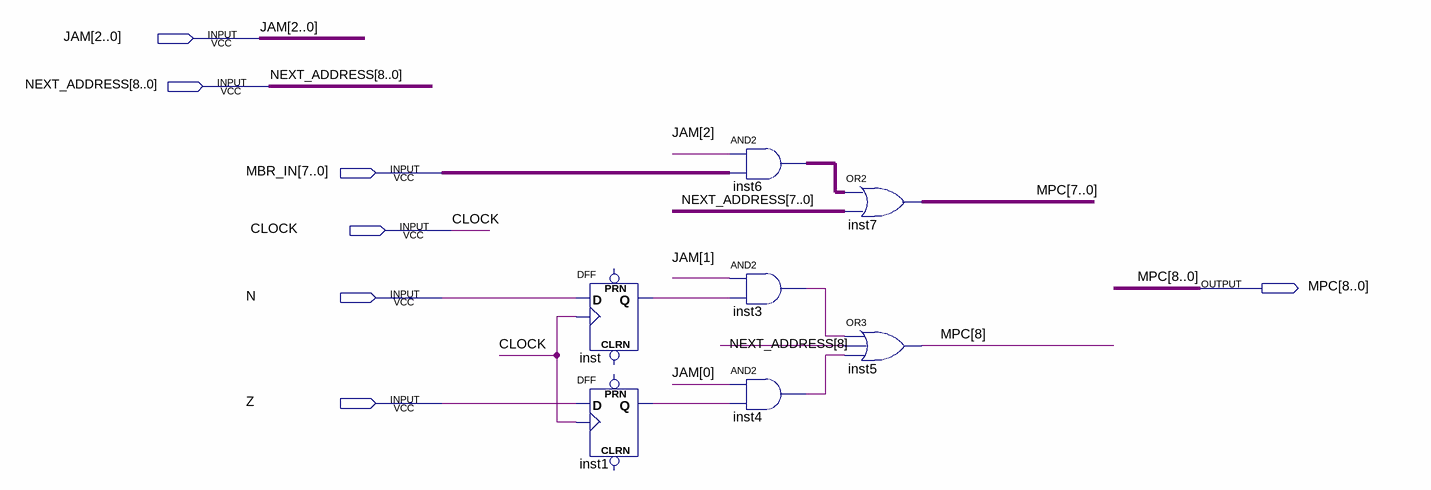
[diagram p0: schematic sheet]
// Quartus schematic MPC.bdf as structural Verilog: 7 symbols, 7 pins
module MPC (
  input  [2:0] JAM,
  input  [8:0] NEXT_ADDRESS,
  input  [7:0] MBR_IN,
  input  CLOCK,
  input  N,
  input  Z,
  output [8:0] MPC
);

  wire inst1_q, inst3_out, inst4_out, inst_q;
  wire [7:0] inst6_out;

  DFF inst (.CLK(CLOCK), .D(N), .Q(inst_q));  // open: CLRN, PRN
  DFF inst1 (.CLK(CLOCK), .D(Z), .Q(inst1_q));  // open: CLRN, PRN
  assign inst6_out = {8{JAM[2]}} & MBR_IN;  // AND2 inst6, 8 bits wide
  and inst3 (inst3_out, JAM[1], inst_q);
  and inst4 (inst4_out, JAM[0], inst1_q);
  assign MPC[7:0] = inst6_out | NEXT_ADDRESS[7:0];  // OR2 inst7, 8 bits wide
  or inst5 (MPC[8], inst3_out, NEXT_ADDRESS[8], inst4_out);
endmodule
